# Altium schematic sheet [8]Battery Managment.SchDoc
size B
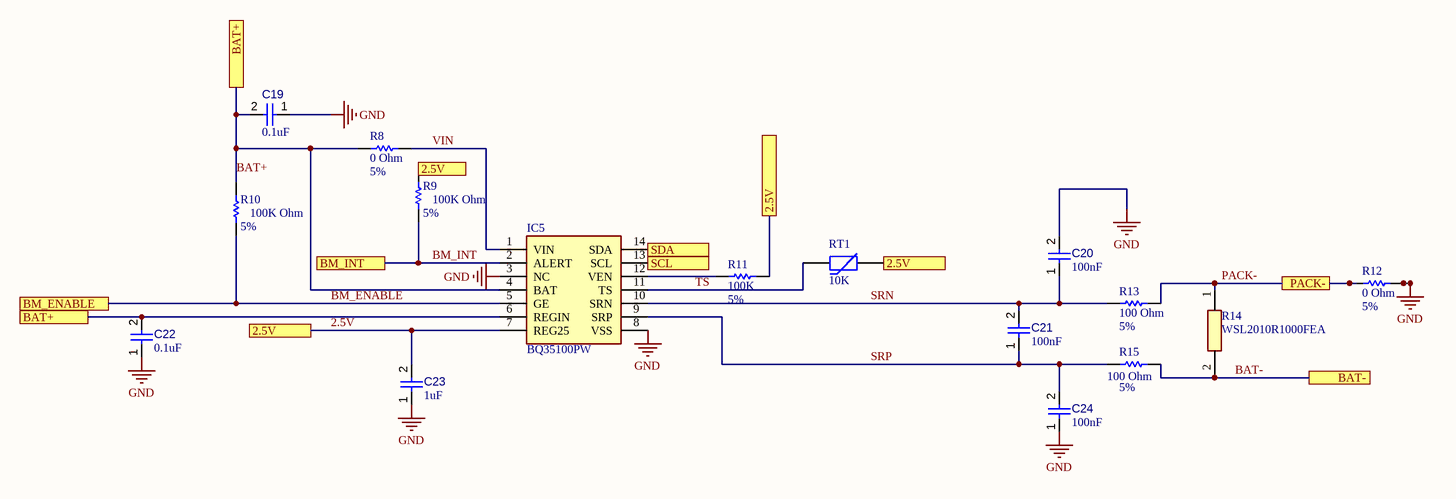
[diagram p0: [8]Battery Managment.SchDoc]

## Parts
C19  0.1uF  [CAPC1608X90X40ML10T20]
C20  value 100nF  [CAPC1608X90X40ML10T20]  (hidden comment: Capacitor 100 nF +/-10% 50 V 0603)
C21  value 100nF  [CAPC1608X90X40ML10T20]  (hidden comment: Capacitor 100 nF +/-10% 50 V 0603)
C22  0.1uF  [CAPC1608X90X40ML10T20]
C23  1uF  [CAPC1608X90X40ML10T20]
C24  value 100nF  [CAPC1608X90X40ML10T20]  (hidden comment: Capacitor 100 nF +/-10% 50 V 0603)
IC5  BQ35100PW  [SOP65P640X120-14N]
R8  value 0 Ohm  Tolerance: 5%  [RES 0603]  (hidden comment: RES 0 Ohm 5% 0.1W [0603])
R9  value 100K Ohm  Tolerance: 5%  [RES 0603]  (hidden comment: RES 100K 5% 0.1W [0603])
R10  value 100K Ohm  Tolerance: 5%  [RES 0603]  (hidden comment: RES 100K 5% 0.1W [0603])
R11  value 100K  Tolerance: 5%  [RES 0603]  (hidden comment: RES 0 Ohm 100K % 0.1W [0603])
R12  value 0 Ohm  Tolerance: 5%  [RES 0603]  (hidden comment: RES 0 Ohm 5% 0.1W [0603])
R13  Tolerance: 5%  [RES 0603]  (hidden comment: 100 Ohm)
R14  WSL2010R1000FEA  [RESC5025X88N]
R15  Tolerance: 5%  [RES 0603]  (hidden comment: 100 Ohm)
RT1  10K  [RESC0603]

## Ports
2.5V, BAT+, BAT-, BM_ENABLE, BM_INT, PACK-, SCL, SDA

## Nets
GND: C19.1 C20.2 C22.1 C23.1 C24.1 IC5.3(NC) IC5.8(VSS) R12.2
2.5V: C23.2 IC5.7(REG25) R9.2 R11.2 RT1.2 ; port 2.5V
BAT+: C19.2 C22.2 IC5.4(BAT) IC5.6(REGIN) R8.1 R10.2 ; port BAT+
BAT-: R14.2 R15.1 ; port BAT-
BM_ENABLE: IC5.5(GE) R10.1 ; port BM_ENABLE
BM_INT: IC5.2(ALERT) R9.1 ; port BM_INT
PACK-: R12.1 R13.1 R14.1 ; port PACK-
SCL: IC5.13(SCL) ; port SCL
SDA: IC5.14(SDA) ; port SDA
SRN: C20.1 C21.2 IC5.10(SRN) R13.2
SRP: C21.1 C24.2 IC5.9(SRP) R15.2
TS: IC5.11(TS) RT1.1
VIN: IC5.1(VIN) R8.2
NetIC5_12: IC5.12(VEN) R11.1

## Library data of the parts
C19 C22 = CMP-001-00017-4: Chip Capacitor, 0.1 uF, +/- 10%, 50 V, 0603 (1608 Metric); Capacitor Type: Ceramic; Voltage Rating: 50V; RoHS Compliant: True; Value: 0.1uF; Max Operating Temperature: 125°C; Pins: 2; Mounting Technology: SM; Min Operating Temperature: -55°C; Tolerance: 10%; Case/Package: 0603
C20 C21 C24 = CMP-001-00017-4: Chip Capacitor, 100 nF, +/- 10%, 50 V, 0603 (1608 Metric); Capacitor Type: Ceramic; Voltage Rating: 50V; RoHS Compliant: True; Max Operating Temperature: 125°C; Pins: 2; Mounting Technology: SM; Min Operating Temperature: -55°C; Tolerance: 10%; Case/Package: 0603
C23 = CMP-001-00017-4: Chip Capacitor, 1 uF, +/- 10%, 50 V, 0603 (1608 Metric); Capacitor Type: Ceramic; Voltage Rating: 50V; RoHS Compliant: True; Value: 1uF; Max Operating Temperature: 125°C; Pins: 2; Mounting Technology: SM; Min Operating Temperature: -55°C; Tolerance: 10%; Case/Package: 0603
IC5 = BQ35100PW: Integrated Circuit; Manufacturer_Name: Texas Instruments; Datasheet Link: http://www.ti.com/lit/gpn/bq35100; Height: 1.2mm; Manufacturer_Part_Number: BQ35100PW; Arrow Part Number: BQ35100PW; Arrow Price/Stock: https://www.arrow.com/en/products/bq35100pw/texas-instruments; Mouser Part Number: 595-BQ35100PW; Mouser Price/Stock: https://www.mouser.co.uk/ProductDetail/Texas-Instruments/BQ35100PW?qs=Jwe3UnxISIaIuldqtot6tg%3D%3D
R8 R12 = RES 0 Ohm [0603]: PN: ERJ-3GEY0R00V; Supplier 1: Mouser; Supplier Part Number 1: 667-ERJ-3GEY0R00V; Datasheet: http://industrial.panasonic.com/cdbs/www-data/pdf/RDA0000/AOA0000C301.pdf?src-supplier=Farnell
R9 R10 = RES 1M 1% 0.1W [0603]: PN: CR0603-FX-1004ELF; Supplier 1: Mouser; Supplier Part Number 1: 652-CR0603FX-1004ELF; Datasheet: https://uk.rs-online.com/webdocs/0fcd/0900766b80fcdb72.pdf?src-supplier=RSComponents; Power: 0.1W
R11 = RES 0 Ohm [0603]: RES 100K Ohm 5% 0.1W [0603]; PN: ERJ-3GEY0R00V; Supplier 1: Mouser; Supplier Part Number 1: 667-ERJ-3GEY0R00V; Datasheet: http://industrial.panasonic.com/cdbs/www-data/pdf/RDA0000/AOA0000C301.pdf?src-supplier=Farnell
R13 R15 = RES 3.3M 1% 0.1W [0603]: RES 100 Ohm 5% 0.1W [0603]; PN: CRCW06033M30FKEA; Supplier 1: Digi-Key; Supplier Part Number 1: 541-3.30MHCT-ND; Value: 100 Ohm
R14 = WSL2010R0100FEA: 0.1 Ohm Resistor; Manufacturer_Name: Vishay; Datasheet Link: http://componentsearchengine.com/Datasheets/1/WSL2010R0100FEA.pdf; Manufacturer_Part_Number: WSL2010R0100FEA; Mouser Part Number: 71-WSL2010R0100FEA; Mouser Price/Stock: https://www.mouser.co.uk/ProductDetail/Vishay-Dale/WSL2010R0100FEA?qs=vgLn9hCS5y9zV4J1uLqJFA%3D%3D; Arrow Part Number: WSL2010R0100FEA; Arrow Price/Stock: https://www.arrow.com/en/products/wsl2010r0100fea/vishay
RT1 = ERT-J1VG103JA: NTC THERMISTOR 10K OHM 5% 0603; Manufacturer: Panasonic Electronic Components; B Value Tolerance: ±1%; B25/50: 3375K; B25/85: 3435K; Supplier 1: Digi-Key; Manufacturer Part Number: ERT-J1VG103JA; RoHS: RoHS Compliant; Category: Sensors, Transducers; Stock 1: 76880; Pricing 1: 1=0.32, 5=0.314, 10=0.278, 25=0.2568, 50=0.2052, 100=0.176, 500=0.15392, 1000=0.13193 (CAD); Packaging: Cut Tape (CT); Part Status: Active; Resistance in Ohms @ 25°C: 10k; Resistance Tolerance: ±5%; B0/50: -; B25/75: -; B25/100: -; Operating Temperature: -40°C ~ 125°C; Length - Lead Wire: -; Mounting Type: Surface Mount; Package / Case: 0603 (1608 Metric); ComponentLink1URL: http://industrial.panasonic.com/www-cgi/jvcr13pz.cgi?E+PZ+3+AUA0001+ERTJ1VG103JA+7+WW; ComponentLink1Description: http://industrial.panasonic.com/www-cgi/jvcr13pz.cgi?E+PZ+3+AUA0001+ERTJ1VG103JA+7+WW; Supplier Part Number 1: P12014CT-ND